# Altium schematic sheet mach nguon sch.SchDoc
size A
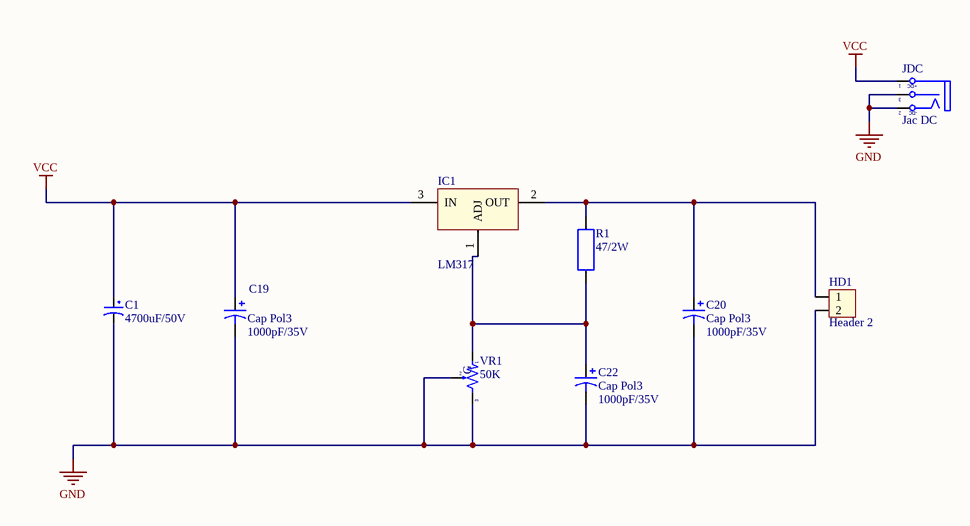
[diagram p0: mach nguon sch.SchDoc]

## Parts
C1  4700uF/50V  [CP4/8.5]
C19  Cap Pol3  value 1000pF/35V  [CP2/5]
C20  Cap Pol3  value 1000pF/35V  [CP2/5]
C22  Cap Pol3  value 1000pF/35V  [CP2/5]
HD1  Header 2  [HED2]
IC1  LM317  [QTO-220]
JDC  Jac DC  [DC-IN]
R1  47/2W  [R2W]
VR1  50K  [VR-S1]

## Nets
GND: C1.2 C19.2 C20.2 C22.2 HD1.2 JDC.2(TN) JDC.3(S) VR1.2 VR1.3
VCC: C1.1 C19.1 IC1.3(IN) JDC.1(T)
NetC20_1: C20.1 HD1.1 IC1.2(OUT) R1.2
NetC22_1: C22.1 IC1.1(ADJ) R1.1 VR1.1

## Notes on the sheet
- (in symbol DCIN) +DC; -DC
- (in symbol VR-S) G

## Library data of the parts
C1 = CP7: Cap 4700uF/50V; Value: 4700uF/50V
C19 = Cap Pol3_1: Polarized Capacitor (Surface Mount); VALUE: C?; LatestRevisionDate: 17-Jul-2002; LatestRevisionNote: Re-released for DXP Platform.; PackageReference: C0805; Publisher: Altium Limited
C20 = Cap Pol3_2: Polarized Capacitor (Surface Mount); VALUE: C?; LatestRevisionDate: 17-Jul-2002; LatestRevisionNote: Re-released for DXP Platform.; PackageReference: C0805; Publisher: Altium Limited
C22 = Cap Pol3_3: Polarized Capacitor (Surface Mount); VALUE: C?; LatestRevisionDate: 17-Jul-2002; LatestRevisionNote: Re-released for DXP Platform.; PackageReference: C0805; Publisher: Altium Limited
HD1 = Hed2: Header 2 (Green); Value: Header 2
IC1 = LM317: Adj Voltage +1.2 -> +37V; Value: LM317
JDC = DCIN: Jac DC input; Value: Jac DC
R1 = R2W: Resistor 2W; Value: R2W - 47
VR1 = VR-S: Var Resistor; Value: Volume 50k